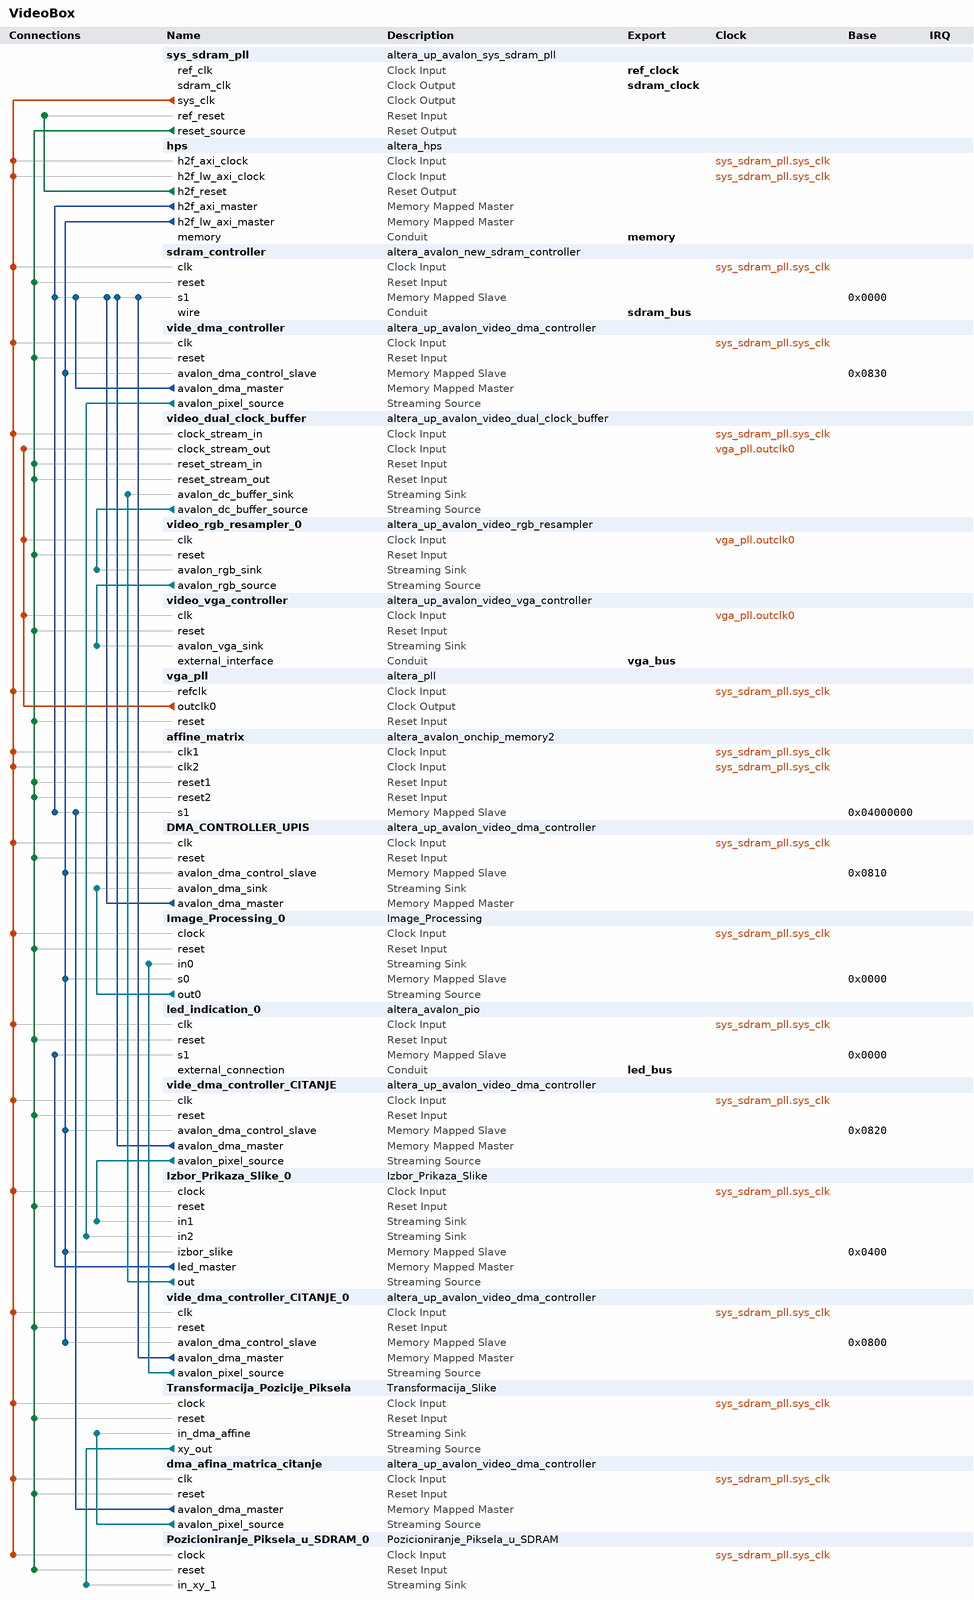
[diagram p0: system contents]
# Platform Designer (Qsys) system VideoBox, Cyclone V 5CSEMA5F31C6
# Parameters at their usual value, and those the tool derives, are not listed.
package require -exact qsys 16.1
create_system VideoBox
set_project_property DEVICE_FAMILY {Cyclone V}
set_project_property DEVICE 5CSEMA5F31C6

add_instance sys_sdram_pll altera_up_avalon_sys_sdram_pll 16.1
set_instance_parameter_value sys_sdram_pll CV_boards DE1-SoC
set_instance_parameter_value sys_sdram_pll gui_outclk 100.0
set_instance_parameter_value sys_sdram_pll gui_refclk 50.0

add_instance hps altera_hps 16.1
set_instance_parameter_value hps EMAC1_Mode N/A
set_instance_parameter_value hps EMAC1_PinMuxing Unused
set_instance_parameter_value hps F2SCLK_COLDRST_Enable false
set_instance_parameter_value hps F2SCLK_DBGRST_Enable false
set_instance_parameter_value hps F2SCLK_WARMRST_Enable false
set_instance_parameter_value hps F2SINTERRUPT_Enable false
set_instance_parameter_value hps F2S_Width 0
set_instance_parameter_value hps FPGA_PERIPHERAL_OUTPUT_CLOCK_FREQ_EMAC0_GTX_CLK 125
set_instance_parameter_value hps FPGA_PERIPHERAL_OUTPUT_CLOCK_FREQ_EMAC0_MD_CLK 2.5
set_instance_parameter_value hps FPGA_PERIPHERAL_OUTPUT_CLOCK_FREQ_EMAC1_GTX_CLK 125
set_instance_parameter_value hps FPGA_PERIPHERAL_OUTPUT_CLOCK_FREQ_EMAC1_MD_CLK 2.5
set_instance_parameter_value hps HPS_PROTOCOL DDR3
set_instance_parameter_value hps I2C0_Mode N/A
set_instance_parameter_value hps I2C0_PinMuxing Unused
set_instance_parameter_value hps I2C1_Mode N/A
set_instance_parameter_value hps I2C1_PinMuxing Unused
set_instance_parameter_value hps LWH2F_Enable true
set_instance_parameter_value hps MEM_BANKADDR_WIDTH 3
set_instance_parameter_value hps MEM_CLK_FREQ 400.0
set_instance_parameter_value hps MEM_COL_ADDR_WIDTH 10
set_instance_parameter_value hps MEM_DQ_WIDTH 32
set_instance_parameter_value hps MEM_DRV_STR RZQ/7
set_instance_parameter_value hps MEM_ROW_ADDR_WIDTH 15
set_instance_parameter_value hps MEM_RTT_NOM RZQ/4
set_instance_parameter_value hps MEM_RTT_WR RZQ/4
set_instance_parameter_value hps MEM_TCL 11
set_instance_parameter_value hps MEM_TFAW_NS 30.0
set_instance_parameter_value hps MEM_TRAS_NS 35.0
set_instance_parameter_value hps MEM_TRCD_NS 13.75
set_instance_parameter_value hps MEM_TRFC_NS 260.0
set_instance_parameter_value hps MEM_TRP_NS 13.75
set_instance_parameter_value hps MEM_VENDOR Micron
set_instance_parameter_value hps MEM_WTCL 8
set_instance_parameter_value hps QSPI_Mode N/A
set_instance_parameter_value hps QSPI_PinMuxing Unused
set_instance_parameter_value hps REF_CLK_FREQ 25.0
set_instance_parameter_value hps S2FCLK_USER2CLK 5
set_instance_parameter_value hps S2F_Width 2
set_instance_parameter_value hps SDIO_Mode N/A
set_instance_parameter_value hps SDIO_PinMuxing Unused
set_instance_parameter_value hps SPIM1_Mode N/A
set_instance_parameter_value hps SPIM1_PinMuxing Unused
set_instance_parameter_value hps STM_Enable false
set_instance_parameter_value hps TIMING_BOARD_AC_SKEW 0.02
set_instance_parameter_value hps TIMING_BOARD_AC_TO_CK_SKEW 0.01
set_instance_parameter_value hps TIMING_BOARD_DQ_TO_DQS_SKEW 0.05
set_instance_parameter_value hps TIMING_BOARD_MAX_CK_DELAY 0.03
set_instance_parameter_value hps TIMING_BOARD_MAX_DQS_DELAY 0.02
set_instance_parameter_value hps TIMING_BOARD_SKEW_BETWEEN_DQS 0.06
set_instance_parameter_value hps TIMING_BOARD_SKEW_CKDQS_DIMM_MAX 0.12
set_instance_parameter_value hps TIMING_BOARD_SKEW_CKDQS_DIMM_MIN 0.06
set_instance_parameter_value hps TIMING_BOARD_SKEW_WITHIN_DQS 0.01
set_instance_parameter_value hps TIMING_TDH 65
set_instance_parameter_value hps TIMING_TDQSCK 255
set_instance_parameter_value hps TIMING_TDQSQ 125
set_instance_parameter_value hps TIMING_TDS 30
set_instance_parameter_value hps TIMING_TIH 140
set_instance_parameter_value hps TIMING_TIS 180
set_instance_parameter_value hps TIMING_TQSH 0.4
set_instance_parameter_value hps UART0_Mode N/A
set_instance_parameter_value hps UART0_PinMuxing Unused
set_instance_parameter_value hps USB1_Mode N/A
set_instance_parameter_value hps USB1_PinMuxing Unused
set_instance_parameter_value hps desired_cfg_clk_mhz 100.0
set_instance_parameter_value hps desired_qspi_clk_mhz 400.0

add_instance sdram_controller altera_avalon_new_sdram_controller 16.1
set_instance_parameter_value sdram_controller TAC 5.4
set_instance_parameter_value sdram_controller TRCD 15.0
set_instance_parameter_value sdram_controller TRP 15.0
set_instance_parameter_value sdram_controller casLatency 3
set_instance_parameter_value sdram_controller columnWidth 10
set_instance_parameter_value sdram_controller dataWidth 16
set_instance_parameter_value sdram_controller generateSimulationModel false
set_instance_parameter_value sdram_controller model single_Micron_MT48LC4M32B2_7_chip
set_instance_parameter_value sdram_controller numberOfBanks 4
set_instance_parameter_value sdram_controller numberOfChipSelects 1
set_instance_parameter_value sdram_controller powerUpDelay 100.0
set_instance_parameter_value sdram_controller refreshPeriod 7.8125
set_instance_parameter_value sdram_controller rowWidth 13

add_instance vide_dma_controller altera_up_avalon_video_dma_controller 16.1
set_instance_parameter_value vide_dma_controller addr_mode Consecutive
set_instance_parameter_value vide_dma_controller back_start_address 614400
set_instance_parameter_value vide_dma_controller color_bits 16
set_instance_parameter_value vide_dma_controller color_planes 1
set_instance_parameter_value vide_dma_controller dma_enabled true
set_instance_parameter_value vide_dma_controller height 480
set_instance_parameter_value vide_dma_controller mode {From Memory to Stream}
set_instance_parameter_value vide_dma_controller start_address 614400
set_instance_parameter_value vide_dma_controller width 640

add_instance video_dual_clock_buffer altera_up_avalon_video_dual_clock_buffer 16.1
set_instance_parameter_value video_dual_clock_buffer color_bits 16
set_instance_parameter_value video_dual_clock_buffer color_planes 1

add_instance video_rgb_resampler_0 altera_up_avalon_video_rgb_resampler 16.1
set_instance_parameter_value video_rgb_resampler_0 alpha 1023
set_instance_parameter_value video_rgb_resampler_0 input_type {16-bit RGB}
set_instance_parameter_value video_rgb_resampler_0 output_type {30-bit RGB}

add_instance video_vga_controller altera_up_avalon_video_vga_controller 16.1
set_instance_parameter_value video_vga_controller board DE1-SoC
set_instance_parameter_value video_vga_controller resolution {VGA 640x480}

add_instance vga_pll altera_pll 16.1
set_instance_parameter_value vga_pll gui_device_speed_grade 2
set_instance_parameter_value vga_pll gui_number_of_clocks 1
set_instance_parameter_value vga_pll gui_operation_mode direct
set_instance_parameter_value vga_pll gui_output_clock_frequency0 25.0
set_instance_parameter_value vga_pll gui_pll_mode {Integer-N PLL}
set_instance_parameter_value vga_pll gui_reference_clock_frequency 100.0
set_instance_parameter_value vga_pll gui_use_locked true

add_instance affine_matrix altera_avalon_onchip_memory2 16.1
set_instance_parameter_value affine_matrix dataWidth 32
set_instance_parameter_value affine_matrix dualPort true
set_instance_parameter_value affine_matrix initMemContent true
set_instance_parameter_value affine_matrix initializationFileName onchip_mem.hex
set_instance_parameter_value affine_matrix memorySize 4096

add_instance DMA_CONTROLLER_UPIS altera_up_avalon_video_dma_controller 16.1
set_instance_parameter_value DMA_CONTROLLER_UPIS addr_mode Consecutive
set_instance_parameter_value DMA_CONTROLLER_UPIS back_start_address 614400
set_instance_parameter_value DMA_CONTROLLER_UPIS color_bits 16
set_instance_parameter_value DMA_CONTROLLER_UPIS color_planes 1
set_instance_parameter_value DMA_CONTROLLER_UPIS dma_enabled true
set_instance_parameter_value DMA_CONTROLLER_UPIS height 480
set_instance_parameter_value DMA_CONTROLLER_UPIS mode {From Stream to Memory}
set_instance_parameter_value DMA_CONTROLLER_UPIS start_address 614400
set_instance_parameter_value DMA_CONTROLLER_UPIS width 640

add_instance Image_Processing_0 Image_Processing 1.0

add_instance led_indication_0 altera_avalon_pio 16.1
set_instance_parameter_value led_indication_0 direction Output
set_instance_parameter_value led_indication_0 width 8

add_instance vide_dma_controller_CITANJE altera_up_avalon_video_dma_controller 16.1
set_instance_parameter_value vide_dma_controller_CITANJE addr_mode Consecutive
set_instance_parameter_value vide_dma_controller_CITANJE back_start_address 0
set_instance_parameter_value vide_dma_controller_CITANJE color_bits 16
set_instance_parameter_value vide_dma_controller_CITANJE color_planes 1
set_instance_parameter_value vide_dma_controller_CITANJE dma_enabled true
set_instance_parameter_value vide_dma_controller_CITANJE height 480
set_instance_parameter_value vide_dma_controller_CITANJE mode {From Memory to Stream}
set_instance_parameter_value vide_dma_controller_CITANJE start_address 0
set_instance_parameter_value vide_dma_controller_CITANJE width 640

add_instance Izbor_Prikaza_Slike_0 Izbor_Prikaza_Slike 1.0

add_instance vide_dma_controller_CITANJE_0 altera_up_avalon_video_dma_controller 16.1
set_instance_parameter_value vide_dma_controller_CITANJE_0 addr_mode Consecutive
set_instance_parameter_value vide_dma_controller_CITANJE_0 back_start_address 0
set_instance_parameter_value vide_dma_controller_CITANJE_0 color_bits 16
set_instance_parameter_value vide_dma_controller_CITANJE_0 color_planes 1
set_instance_parameter_value vide_dma_controller_CITANJE_0 dma_enabled true
set_instance_parameter_value vide_dma_controller_CITANJE_0 height 480
set_instance_parameter_value vide_dma_controller_CITANJE_0 mode {From Memory to Stream}
set_instance_parameter_value vide_dma_controller_CITANJE_0 start_address 0
set_instance_parameter_value vide_dma_controller_CITANJE_0 width 640

add_instance Transformacija_Pozicije_Piksela Transformacija_Slike 1.0

add_instance dma_afina_matrica_citanje altera_up_avalon_video_dma_controller 16.1
set_instance_parameter_value dma_afina_matrica_citanje addr_mode Consecutive
set_instance_parameter_value dma_afina_matrica_citanje back_start_address 0
set_instance_parameter_value dma_afina_matrica_citanje color_bits 16
set_instance_parameter_value dma_afina_matrica_citanje color_planes 4
set_instance_parameter_value dma_afina_matrica_citanje dma_enabled true
set_instance_parameter_value dma_afina_matrica_citanje height 1
set_instance_parameter_value dma_afina_matrica_citanje mode {From Memory to Stream}
set_instance_parameter_value dma_afina_matrica_citanje start_address 0
set_instance_parameter_value dma_afina_matrica_citanje width 1

add_instance Pozicioniranje_Piksela_u_SDRAM_0 Pozicioniranje_Piksela_u_SDRAM 1.0

# connections
add_connection sys_sdram_pll.sys_clk affine_matrix.clk1 clock
add_connection sys_sdram_pll.sys_clk affine_matrix.clk2 clock
add_connection sys_sdram_pll.sys_clk dma_afina_matrica_citanje.clk clock
add_connection sys_sdram_pll.sys_clk DMA_CONTROLLER_UPIS.clk clock
add_connection sys_sdram_pll.sys_clk hps.h2f_axi_clock clock
add_connection sys_sdram_pll.sys_clk hps.h2f_lw_axi_clock clock
add_connection sys_sdram_pll.sys_clk Image_Processing_0.clock clock
add_connection sys_sdram_pll.sys_clk Izbor_Prikaza_Slike_0.clock clock
add_connection sys_sdram_pll.sys_clk led_indication_0.clk clock
add_connection sys_sdram_pll.sys_clk Pozicioniranje_Piksela_u_SDRAM_0.clock clock
add_connection sys_sdram_pll.sys_clk sdram_controller.clk clock
add_connection sys_sdram_pll.sys_clk Transformacija_Pozicije_Piksela.clock clock
add_connection sys_sdram_pll.sys_clk vga_pll.refclk clock
add_connection sys_sdram_pll.sys_clk vide_dma_controller.clk clock
add_connection sys_sdram_pll.sys_clk vide_dma_controller_CITANJE.clk clock
add_connection sys_sdram_pll.sys_clk vide_dma_controller_CITANJE_0.clk clock
add_connection sys_sdram_pll.sys_clk video_dual_clock_buffer.clock_stream_in clock
add_connection vga_pll.outclk0 video_dual_clock_buffer.clock_stream_out clock
add_connection vga_pll.outclk0 video_rgb_resampler_0.clk clock
add_connection vga_pll.outclk0 video_vga_controller.clk clock
add_connection hps.h2f_reset sys_sdram_pll.ref_reset reset
add_connection sys_sdram_pll.reset_source affine_matrix.reset1 reset
add_connection sys_sdram_pll.reset_source affine_matrix.reset2 reset
add_connection sys_sdram_pll.reset_source dma_afina_matrica_citanje.reset reset
add_connection sys_sdram_pll.reset_source DMA_CONTROLLER_UPIS.reset reset
add_connection sys_sdram_pll.reset_source Image_Processing_0.reset reset
add_connection sys_sdram_pll.reset_source Izbor_Prikaza_Slike_0.reset reset
add_connection sys_sdram_pll.reset_source led_indication_0.reset reset
add_connection sys_sdram_pll.reset_source Pozicioniranje_Piksela_u_SDRAM_0.reset reset
add_connection sys_sdram_pll.reset_source sdram_controller.reset reset
add_connection sys_sdram_pll.reset_source Transformacija_Pozicije_Piksela.reset reset
add_connection sys_sdram_pll.reset_source vga_pll.reset reset
add_connection sys_sdram_pll.reset_source vide_dma_controller.reset reset
add_connection sys_sdram_pll.reset_source vide_dma_controller_CITANJE.reset reset
add_connection sys_sdram_pll.reset_source vide_dma_controller_CITANJE_0.reset reset
add_connection sys_sdram_pll.reset_source video_dual_clock_buffer.reset_stream_in reset
add_connection sys_sdram_pll.reset_source video_dual_clock_buffer.reset_stream_out reset
add_connection sys_sdram_pll.reset_source video_rgb_resampler_0.reset reset
add_connection sys_sdram_pll.reset_source video_vga_controller.reset reset
add_connection dma_afina_matrica_citanje.avalon_dma_master affine_matrix.s1 avalon
set_connection_parameter_value dma_afina_matrica_citanje.avalon_dma_master/affine_matrix.s1 baseAddress 0x04000000
add_connection DMA_CONTROLLER_UPIS.avalon_dma_master sdram_controller.s1 avalon
set_connection_parameter_value DMA_CONTROLLER_UPIS.avalon_dma_master/sdram_controller.s1 baseAddress 0x0000
add_connection hps.h2f_axi_master affine_matrix.s1 avalon
set_connection_parameter_value hps.h2f_axi_master/affine_matrix.s1 baseAddress 0x04000000
add_connection hps.h2f_axi_master sdram_controller.s1 avalon
set_connection_parameter_value hps.h2f_axi_master/sdram_controller.s1 baseAddress 0x0000
add_connection hps.h2f_lw_axi_master DMA_CONTROLLER_UPIS.avalon_dma_control_slave avalon
set_connection_parameter_value hps.h2f_lw_axi_master/DMA_CONTROLLER_UPIS.avalon_dma_control_slave baseAddress 0x0810
add_connection hps.h2f_lw_axi_master Image_Processing_0.s0 avalon
set_connection_parameter_value hps.h2f_lw_axi_master/Image_Processing_0.s0 baseAddress 0x0000
add_connection hps.h2f_lw_axi_master Izbor_Prikaza_Slike_0.izbor_slike avalon
set_connection_parameter_value hps.h2f_lw_axi_master/Izbor_Prikaza_Slike_0.izbor_slike baseAddress 0x0400
add_connection hps.h2f_lw_axi_master vide_dma_controller.avalon_dma_control_slave avalon
set_connection_parameter_value hps.h2f_lw_axi_master/vide_dma_controller.avalon_dma_control_slave baseAddress 0x0830
add_connection hps.h2f_lw_axi_master vide_dma_controller_CITANJE.avalon_dma_control_slave avalon
set_connection_parameter_value hps.h2f_lw_axi_master/vide_dma_controller_CITANJE.avalon_dma_control_slave baseAddress 0x0820
add_connection hps.h2f_lw_axi_master vide_dma_controller_CITANJE_0.avalon_dma_control_slave avalon
set_connection_parameter_value hps.h2f_lw_axi_master/vide_dma_controller_CITANJE_0.avalon_dma_control_slave baseAddress 0x0800
add_connection Izbor_Prikaza_Slike_0.led_master led_indication_0.s1 avalon
set_connection_parameter_value Izbor_Prikaza_Slike_0.led_master/led_indication_0.s1 baseAddress 0x0000
add_connection vide_dma_controller.avalon_dma_master sdram_controller.s1 avalon
set_connection_parameter_value vide_dma_controller.avalon_dma_master/sdram_controller.s1 baseAddress 0x0000
add_connection vide_dma_controller_CITANJE.avalon_dma_master sdram_controller.s1 avalon
set_connection_parameter_value vide_dma_controller_CITANJE.avalon_dma_master/sdram_controller.s1 baseAddress 0x0000
add_connection vide_dma_controller_CITANJE_0.avalon_dma_master sdram_controller.s1 avalon
set_connection_parameter_value vide_dma_controller_CITANJE_0.avalon_dma_master/sdram_controller.s1 baseAddress 0x0000
add_connection dma_afina_matrica_citanje.avalon_pixel_source Transformacija_Pozicije_Piksela.in_dma_affine avalon_streaming
add_connection Image_Processing_0.out0 DMA_CONTROLLER_UPIS.avalon_dma_sink avalon_streaming
add_connection Izbor_Prikaza_Slike_0.out video_dual_clock_buffer.avalon_dc_buffer_sink avalon_streaming
add_connection Transformacija_Pozicije_Piksela.xy_out Pozicioniranje_Piksela_u_SDRAM_0.in_xy_1 avalon_streaming
add_connection vide_dma_controller.avalon_pixel_source Izbor_Prikaza_Slike_0.in2 avalon_streaming
add_connection vide_dma_controller_CITANJE.avalon_pixel_source Izbor_Prikaza_Slike_0.in1 avalon_streaming
add_connection vide_dma_controller_CITANJE_0.avalon_pixel_source Image_Processing_0.in0 avalon_streaming
add_connection video_dual_clock_buffer.avalon_dc_buffer_source video_rgb_resampler_0.avalon_rgb_sink avalon_streaming
add_connection video_rgb_resampler_0.avalon_rgb_source video_vga_controller.avalon_vga_sink avalon_streaming

# exported interfaces
add_interface led_bus conduit end
set_interface_property led_bus EXPORT_OF led_indication_0.external_connection
add_interface memory conduit end
set_interface_property memory EXPORT_OF hps.memory
add_interface ref_clock clock sink
set_interface_property ref_clock EXPORT_OF sys_sdram_pll.ref_clk
add_interface sdram_bus conduit end
set_interface_property sdram_bus EXPORT_OF sdram_controller.wire
add_interface sdram_clock clock source
set_interface_property sdram_clock EXPORT_OF sys_sdram_pll.sdram_clk
add_interface vga_bus conduit end
set_interface_property vga_bus EXPORT_OF video_vga_controller.external_interface

set_interconnect_requirement {$system} qsys_mm.clockCrossingAdapter HANDSHAKE
set_interconnect_requirement {$system} qsys_mm.enableEccProtection FALSE
set_interconnect_requirement {$system} qsys_mm.insertDefaultSlave FALSE
set_interconnect_requirement {$system} qsys_mm.maxAdditionalLatency 1

save_system VideoBox.qsys
